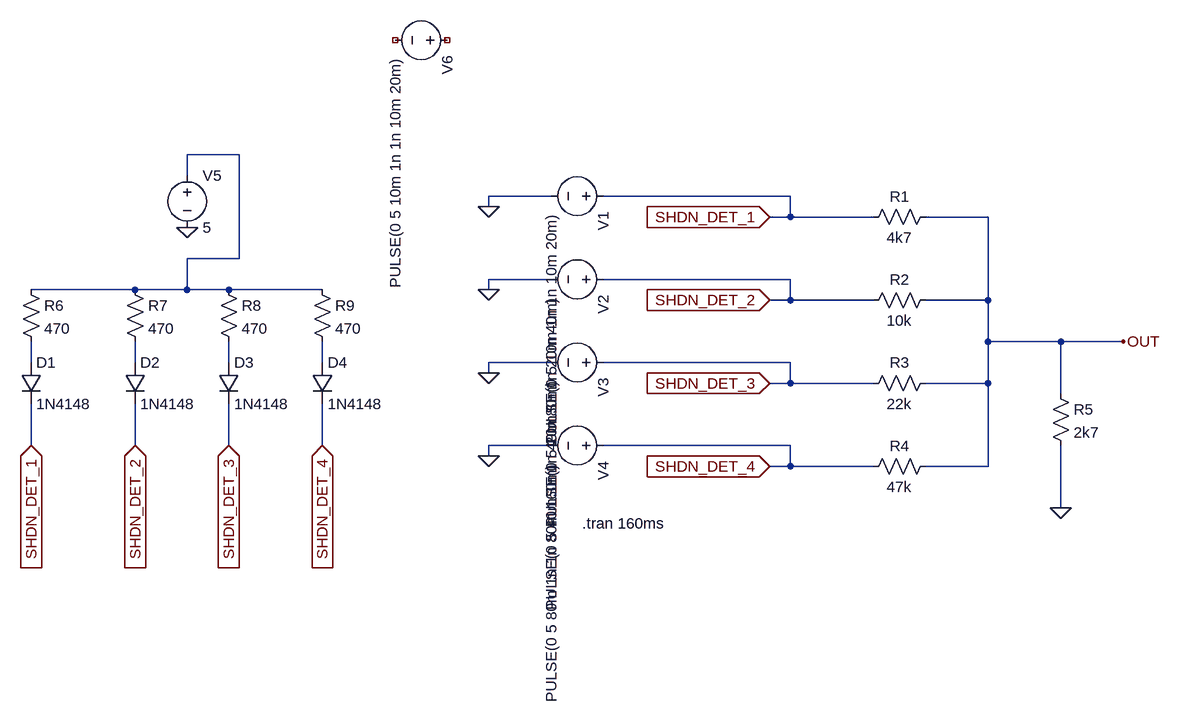
[diagram p0: schematic SHDN21-DAC-LTSpiceSimulation.asc]
SHDN21-DAC-LTSpiceSimulation.asc, the LTspice schematic file:
Version 4
SHEET 1 880 916
WIRE -1024 -304 -1104 -304
WIRE -1104 -272 -1104 -304
WIRE -544 -240 -640 -240
WIRE -176 -240 -464 -240
WIRE -640 -224 -640 -240
WIRE -176 -208 -176 -240
WIRE -176 -208 -208 -208
WIRE -48 -208 -176 -208
WIRE 128 -208 32 -208
WIRE -1024 -144 -1024 -304
WIRE -1024 -144 -1104 -144
WIRE -544 -112 -640 -112
WIRE -176 -112 -464 -112
WIRE -1184 -96 -1344 -96
WIRE -1104 -96 -1104 -144
WIRE -1104 -96 -1184 -96
WIRE -1040 -96 -1104 -96
WIRE -896 -96 -1040 -96
WIRE -640 -96 -640 -112
WIRE -176 -80 -176 -112
WIRE -176 -80 -208 -80
WIRE -48 -80 -176 -80
WIRE 128 -80 128 -208
WIRE 128 -80 32 -80
WIRE 128 -16 128 -80
WIRE 240 -16 128 -16
WIRE 336 -16 240 -16
WIRE -1344 16 -1344 -16
WIRE -1184 16 -1184 -16
WIRE -1040 16 -1040 -16
WIRE -896 16 -896 -16
WIRE -544 16 -640 16
WIRE -176 16 -464 16
WIRE -640 32 -640 16
WIRE -176 48 -176 16
WIRE -176 48 -208 48
WIRE -48 48 -176 48
WIRE 128 48 128 -16
WIRE 128 48 32 48
WIRE 240 64 240 -16
WIRE -1344 144 -1344 80
WIRE -1184 144 -1184 80
WIRE -1040 144 -1040 80
WIRE -896 144 -896 80
WIRE -544 144 -640 144
WIRE -176 144 -464 144
WIRE -640 160 -640 144
WIRE -176 176 -176 144
WIRE -176 176 -208 176
WIRE -48 176 -176 176
WIRE 128 176 128 48
WIRE 128 176 32 176
WIRE 240 240 240 144
FLAG 240 240 0
FLAG 336 -16 OUT
FLAG -208 -208 SHDN_DET_1
IOPIN -208 -208 In
FLAG -208 -80 SHDN_DET_2
IOPIN -208 -80 In
FLAG -208 48 SHDN_DET_3
IOPIN -208 48 In
FLAG -208 176 SHDN_DET_4
IOPIN -208 176 In
FLAG -640 -224 0
FLAG -640 -96 0
FLAG -640 32 0
FLAG -640 160 0
FLAG -1104 -192 0
FLAG -1344 144 SHDN_DET_1
IOPIN -1344 144 In
FLAG -1184 144 SHDN_DET_2
IOPIN -1184 144 In
FLAG -1040 144 SHDN_DET_3
IOPIN -1040 144 In
FLAG -896 144 SHDN_DET_4
IOPIN -896 144 In
SYMBOL res 48 -224 R90
WINDOW 0 0 56 VBottom 2
WINDOW 3 32 56 VTop 2
SYMATTR InstName R1
SYMATTR Value 4k7
SYMATTR SpiceLine tol=5 pwr=.1
SYMBOL res 48 -96 R90
WINDOW 0 0 56 VBottom 2
WINDOW 3 32 56 VTop 2
SYMATTR InstName R2
SYMATTR Value 10k
SYMATTR SpiceLine tol=5 pwr=.1
SYMBOL res 48 32 R90
WINDOW 0 0 56 VBottom 2
WINDOW 3 32 56 VTop 2
SYMATTR InstName R3
SYMATTR Value 22k
SYMATTR SpiceLine tol=5 pwr=.1
SYMBOL res 48 160 R90
WINDOW 0 0 56 VBottom 2
WINDOW 3 32 56 VTop 2
SYMATTR InstName R4
SYMATTR Value 47k
SYMATTR SpiceLine tol=5 pwr=.1
SYMBOL res 224 48 R0
SYMATTR InstName R5
SYMATTR Value 2k7
SYMATTR SpiceLine tol=5 pwr=.1
SYMBOL voltage -448 -240 R90
WINDOW 123 0 0 Left 0
WINDOW 39 0 0 Left 0
SYMATTR InstName V1
SYMATTR Value PULSE(0 5 10m 1n 1n 10m 20m)
SYMBOL voltage -448 -112 R90
WINDOW 123 0 0 Left 0
WINDOW 39 0 0 Left 0
SYMATTR InstName V2
SYMATTR Value PULSE(0 5 20m 1n 1n 20m 40m)
SYMBOL voltage -448 16 R90
WINDOW 123 0 0 Left 0
WINDOW 39 0 0 Left 0
SYMATTR InstName V3
SYMATTR Value PULSE(0 5 40m 1n 1n 40m 80m)
SYMBOL voltage -448 144 R90
WINDOW 123 0 0 Left 0
WINDOW 39 0 0 Left 0
SYMATTR InstName V4
SYMATTR Value PULSE(0 5 80m 1n 1n 80m 160m)
SYMBOL diode -1360 16 R0
SYMATTR InstName D1
SYMATTR Value 1N4148
SYMATTR Description Light Emitting Diode
SYMATTR Type led
SYMBOL diode -1200 16 R0
SYMATTR InstName D2
SYMATTR Value 1N4148
SYMATTR Description Light Emitting Diode
SYMATTR Type led
SYMBOL diode -1056 16 R0
SYMATTR InstName D3
SYMATTR Value 1N4148
SYMATTR Description Light Emitting Diode
SYMATTR Type led
SYMBOL diode -912 16 R0
SYMATTR InstName D4
SYMATTR Value 1N4148
SYMATTR Description Light Emitting Diode
SYMATTR Type led
SYMBOL res -1360 -112 R0
SYMATTR InstName R6
SYMATTR Value 470
SYMATTR SpiceLine tol=5 pwr=0.25
SYMBOL res -1200 -112 R0
SYMATTR InstName R7
SYMATTR Value 470
SYMATTR SpiceLine tol=5 pwr=0.25
SYMBOL res -1056 -112 R0
SYMATTR InstName R8
SYMATTR Value 470
SYMATTR SpiceLine tol=5 pwr=0.25
SYMBOL res -912 -112 R0
SYMATTR InstName R9
SYMATTR Value 470
SYMATTR SpiceLine tol=5 pwr=0.25
SYMBOL voltage -1104 -288 R0
WINDOW 123 0 0 Left 0
WINDOW 39 0 0 Left 0
SYMATTR InstName V5
SYMATTR Value 5
SYMBOL voltage -688 -480 R90
WINDOW 123 0 0 Left 0
WINDOW 39 0 0 Left 0
SYMATTR InstName V6
SYMATTR Value PULSE(0 5 10m 1n 1n 10m 20m)
TEXT -496 264 Left 2 !.tran 160ms

The netlist it stands for:
* SHDN21-DAC-LTSpiceSimulation.asc
R1 OUT SHDN_DET_1 4k7 tol=5 pwr=.1
R2 OUT SHDN_DET_2 10k tol=5 pwr=.1
R3 OUT SHDN_DET_3 22k tol=5 pwr=.1
R4 OUT SHDN_DET_4 47k tol=5 pwr=.1
R5 OUT 0 2k7 tol=5 pwr=.1
V1 SHDN_DET_1 0 PULSE(0 5 10m 1n 1n 10m 20m)
V2 SHDN_DET_2 0 PULSE(0 5 20m 1n 1n 20m 40m)
V3 SHDN_DET_3 0 PULSE(0 5 40m 1n 1n 40m 80m)
V4 SHDN_DET_4 0 PULSE(0 5 80m 1n 1n 80m 160m)
D1 N002 SHDN_DET_1 1N4148
D2 N003 SHDN_DET_2 1N4148
D3 N004 SHDN_DET_3 1N4148
D4 N005 SHDN_DET_4 1N4148
R6 N001 N002 470 tol=5 pwr=0.25
R7 N001 N003 470 tol=5 pwr=0.25
R8 N001 N004 470 tol=5 pwr=0.25
R9 N001 N005 470 tol=5 pwr=0.25
V5 N001 0 5
V6 NC_01 NC_02 PULSE(0 5 10m 1n 1n 10m 20m)
.model D D
.lib standard.dio
.tran 160ms
.backanno
.end